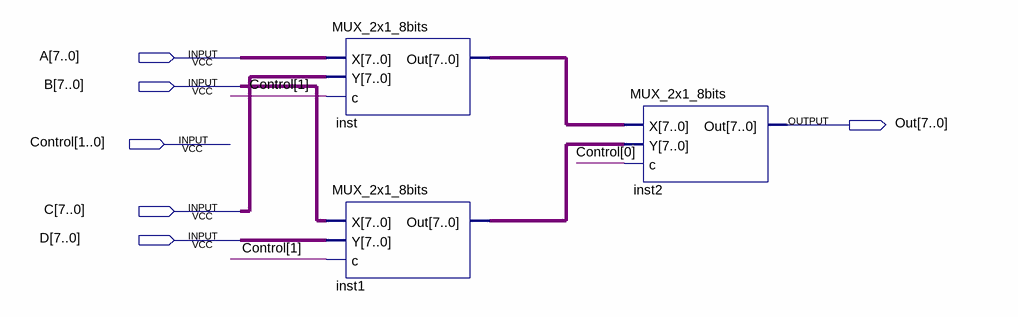
[diagram p0: schematic sheet]
// Quartus schematic MUX_4x1_8bits.bdf as structural Verilog: 3 symbols, 6 pins
module MUX_4x1_8bits (
  input  [7:0] A,
  input  [7:0] B,
  input  [1:0] Control,
  input  [7:0] C,
  input  [7:0] D,
  output [7:0] Out
);

  wire [7:0] inst1_out, inst_out;

  MUX_2x1_8bits inst (.X(A), .Y(C), .c(Control[1]), .Out(inst_out));
  MUX_2x1_8bits inst1 (.X(B), .Y(D), .c(Control[1]), .Out(inst1_out));
  MUX_2x1_8bits inst2 (.X(inst_out), .Y(inst1_out), .c(Control[0]), .Out(Out));
endmodule
